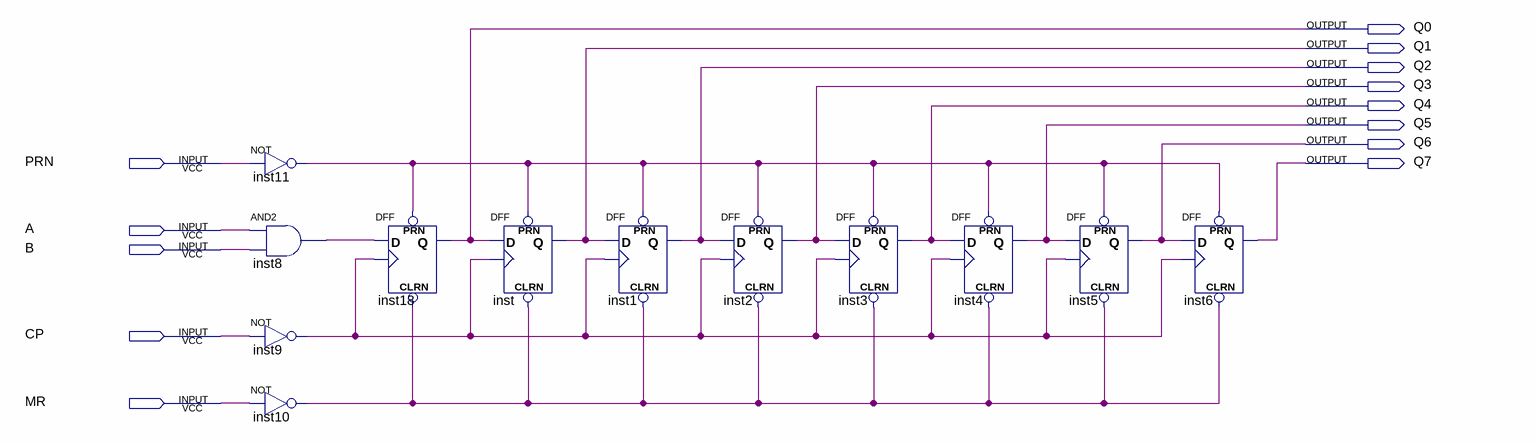
[diagram p0: schematic sheet]
// Quartus schematic sipo_sr.bdf as structural Verilog: 12 symbols, 13 pins
module sipo_sr (
  input  PRN,
  input  A,
  input  B,
  input  CP,
  input  MR,
  output Q0,
  output Q1,
  output Q2,
  output Q3,
  output Q4,
  output Q5,
  output Q6,
  output Q7
);

  wire inst8_out, inst9_out, inst10_out, inst11_out;

  not inst11 (inst11_out, PRN);
  and inst8 (inst8_out, A, B);
  not inst9 (inst9_out, CP);
  not inst10 (inst10_out, MR);
  DFF inst18 (.CLRN(inst10_out), .CLK(inst9_out), .D(inst8_out), .PRN(inst11_out), .Q(Q0));
  DFF inst (.CLRN(inst10_out), .CLK(inst9_out), .D(Q0), .PRN(inst11_out), .Q(Q1));
  DFF inst1 (.CLRN(inst10_out), .CLK(inst9_out), .D(Q1), .PRN(inst11_out), .Q(Q2));
  DFF inst2 (.CLRN(inst10_out), .CLK(inst9_out), .D(Q2), .PRN(inst11_out), .Q(Q3));
  DFF inst3 (.CLRN(inst10_out), .CLK(inst9_out), .D(Q3), .PRN(inst11_out), .Q(Q4));
  DFF inst4 (.CLRN(inst10_out), .CLK(inst9_out), .D(Q4), .PRN(inst11_out), .Q(Q5));
  DFF inst5 (.CLRN(inst10_out), .CLK(inst9_out), .D(Q5), .PRN(inst11_out), .Q(Q6));
  DFF inst6 (.CLRN(inst10_out), .CLK(inst9_out), .D(Q6), .PRN(inst11_out), .Q(Q7));
endmodule
